# Altium project PCB_Project.PrjPcb
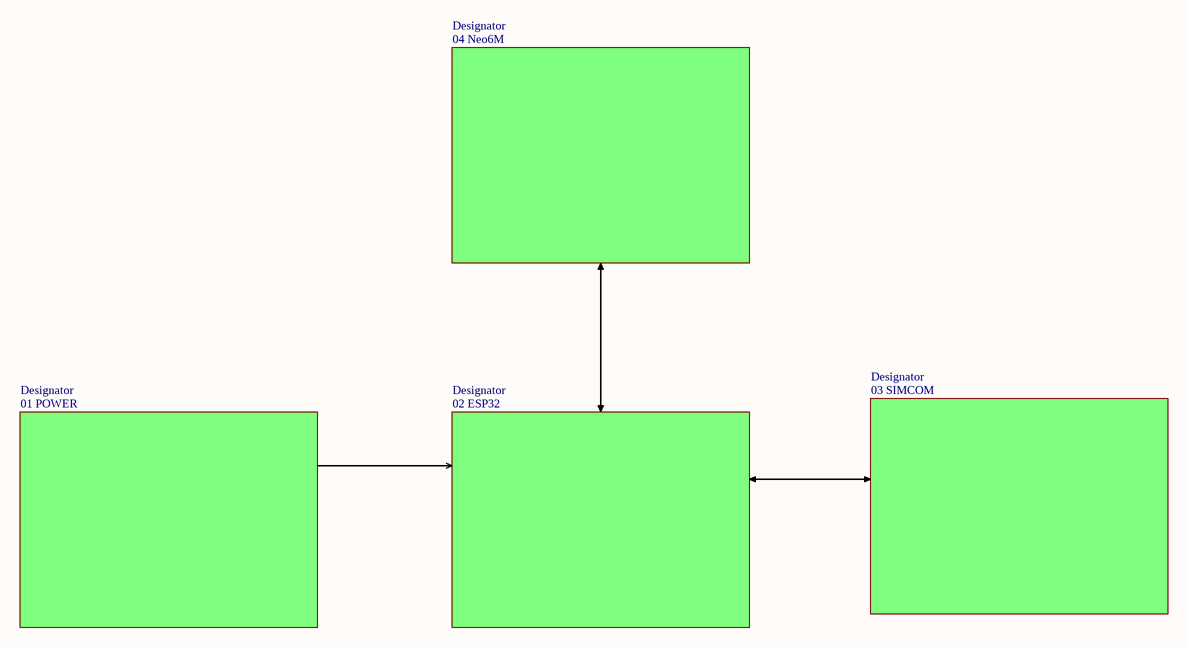
[diagram p0: Sheet1.SchDoc]
5 sheets, 114 parts. Net scope: global (net labels, ports and power ports of the same name join across sheets).
Board file: PCB1.PcbDoc
Sheets:
  Sheet1.SchDoc
    Designator = 01 POWER.SchDoc
    Designator = 02 ESP32.SchDoc
    Designator = 03 SIMCOM.SchDoc
    Designator = 04 Neo6M.SchDoc

## Sheet Sheet1.SchDoc
size A3; SheetNumber: 1; SheetTotal: 5

### Sub-sheets
Designator = 01 POWER: no entries
Designator = 02 ESP32: no entries
Designator = 03 SIMCOM: no entries
Designator = 04 Neo6M: no entries

## Sheet 01 POWER.SchDoc
size A3; SheetNumber: 2; SheetTotal: 5
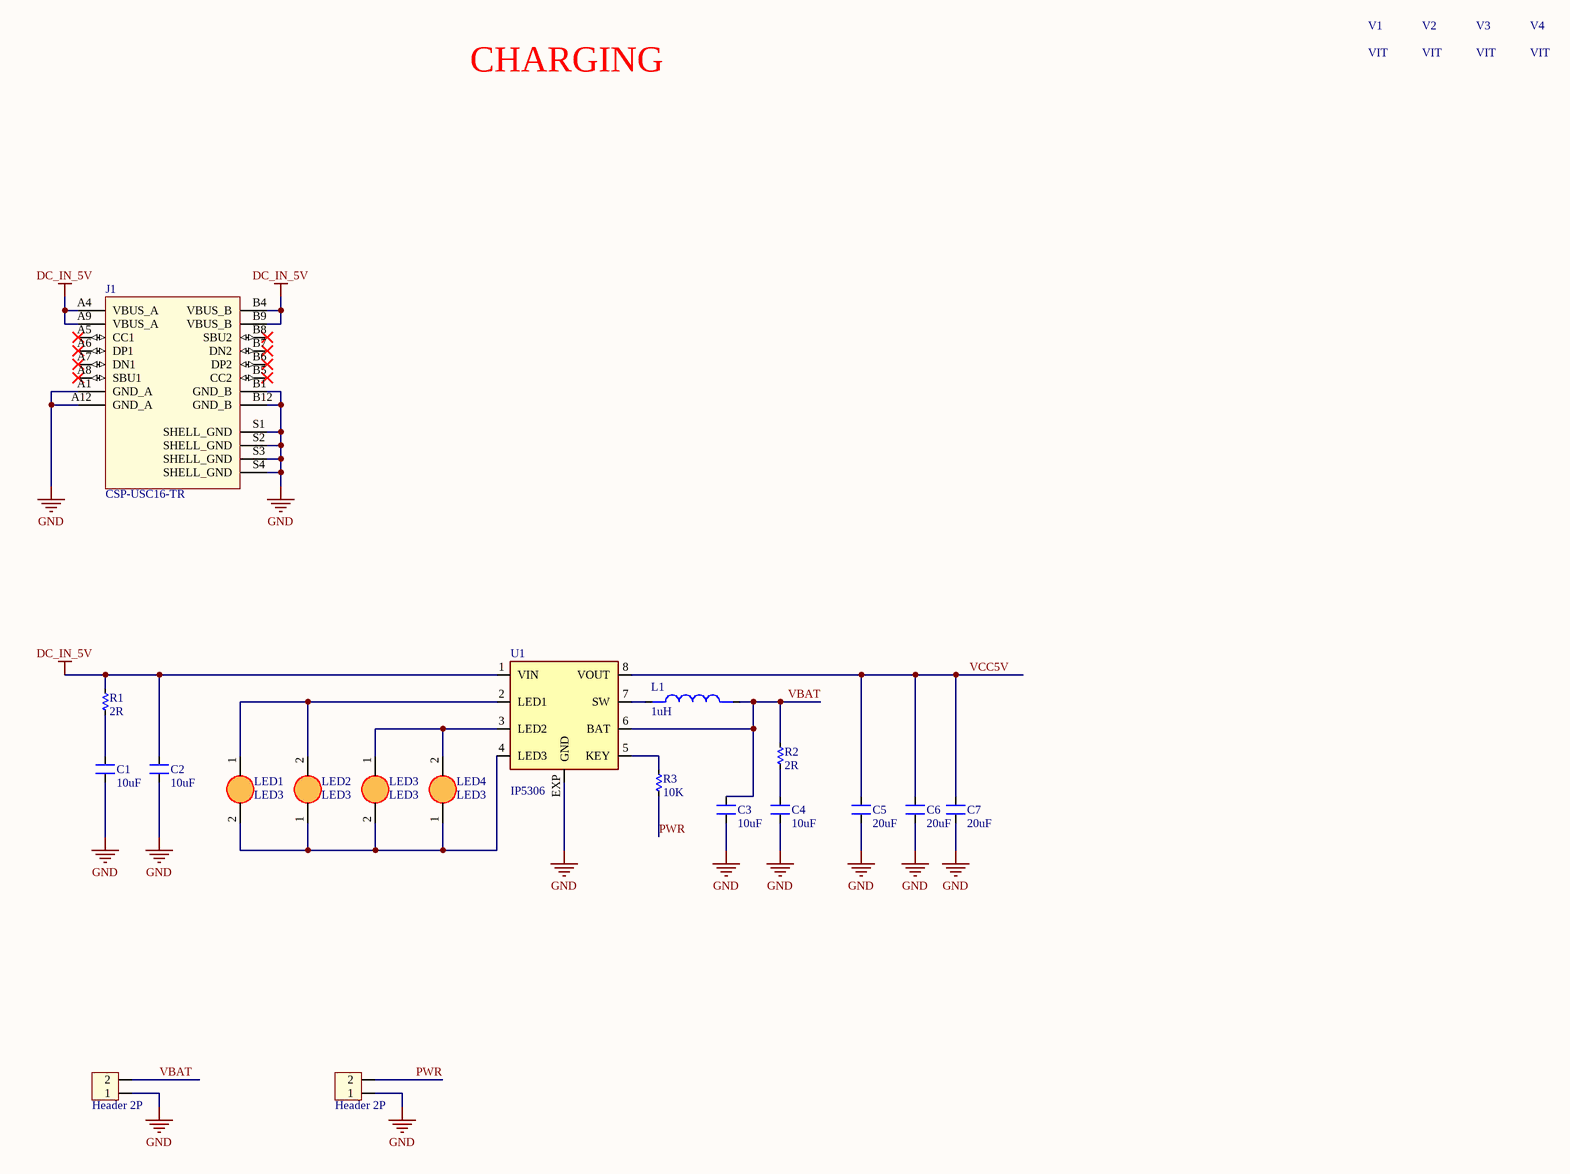
[diagram p1: 01 POWER.SchDoc]

### Parts
C1  10uF  [C 0603]
C2  10uF  [C 0603]
C3  10uF  [C 0603]
C4  10uF  [C 0603]
C5  20uF  [C 0603]
C6  20uF  [C 0603]
C7  20uF  [C 0603]
H1  Header 2P  [Header 2P DC 2.54]
H2  Header 2P  [Header 2P DC 2.54]
J1  CSP-USC16-TR  [VALCON_CSP-USC16-TR]
L1  1uH  [CUON CAM SMD 0530]
LED1  LED3  [LED3mm]
LED2  LED3  [LED3mm]
LED3  LED3  [LED3mm]
LED4  LED3  [LED3mm]
R1  2R  [RES-SMD-0603]
R2  2R  [RES-SMD-0603]
R3  10K  [RES-SMD-0603]
U1  IP5306  [SOP8-P]
V1  VIT  [VIT_01]
V2  VIT  [VIT_01]
V3  VIT  [VIT_01]
V4  VIT  [VIT_01]

### Nets
DC_IN_5V: C2.2 J1.A4(VBUS_A) J1.A9(VBUS_A) J1.B4(VBUS_B) J1.B9(VBUS_B) R1.1 U1.1(VIN)
GND: C1.1 C2.1 C3.1 C4.1 C5.1 C6.1 C7.1 H1.1 H2.1 J1.A1(GND_A) J1.A12(GND_A) J1.B1(GND_B) J1.B12(GND_B) J1.S1(SHELL_GND) J1.S2(SHELL_GND) J1.S3(SHELL_GND) J1.S4(SHELL_GND) U1.EXP(GND)
VCC5V: C5.2 C6.2 C7.2 U1.8(VOUT)
PWR: H2.2 R3.2
VBAT: C3.2 H1.2 L1.2 R2.1 U1.6(BAT)
NetC1_2: C1.2 R1.2
NetC4_2: C4.2 R2.2
NetL1_1: L1.1 U1.7(SW)
NetLED1_1: LED1.1(A) LED2.2(K) U1.2(LED1)
NetLED1_2: LED1.2(K) LED2.1(A) LED3.2(K) LED4.1(A) U1.4(LED3)
NetLED3_1: LED3.1(A) LED4.2(K) U1.3(LED2)
NetR3_1: R3.1 U1.5(KEY)

Not connected (* = marked no-connect by the designer): J1 A5(CC1)* A6(DP1)* A7(DN1)* A8(SBU1)* B5(CC2)* B6(DP2)* B7(DN2)* B8(SBU2)*

### Notes on the sheet
- CHARGING

### Library data of the parts
C1-C7 = CAP_SMD: 16V; Value: 33pF
H1 H2 = Header 2P 2.54 Duc Cong: Cắm; Ten_Linh_Kien: Header 2P XH2.54-2P Đực Cong; Don_Vi: Con; Ma_Hang: MH002852; Chung_Loai: Cắm
J1 = CSP-USC16-TR: CSP-USC16-TR Valcon USB Type C Surface Mount PCB Socket; Package: None; Purchase-URL: https://pricing.snapeda.com/search/part/CSP-USC16-TR/?ref=eda; MP: CSP-USC16-TR; Check_prices: https://www.snapeda.com/parts/CSP-USC16-TR/Valcon/view-part/4783629/?ref=eda; MF: Valcon; Value: *; Availability: No availability data; Price: None; SnapEDA_Link: https://www.snapeda.com/parts/CSP-USC16-TR/Valcon/view-part/4783629/?ref=snap
L1 = Cuon Cam SMD 0530: SMD 0530; MP: FDV0530-H-1R5M=P3; Package: None; Price: None; Value: *; Availability: Unavailable
LED1-LED4 = LED 3mm
R1-R3 = Res-SMD: RES_SMD; Manufacturer: Generic Components; Class: Passive; Published: 08/06/2000; Publisher: Altium Hobart Technology Centre
U1 = IP5306: RC (Pi) EMI Filter 2nd Order Low Pass 2 Channel R = 2.2kOhms, C = 1700pF 8-UFBGA, WLCSP; MF: NXP USA Inc.; Value: *; MP: IP5306; SnapEDA_Link: https://www.snapeda.com/parts/IP5306/NXP+Semiconductors/view-part/?ref=snap; Price: None; Package: UFBGA-8 NXP Semiconductors; Check_prices: https://www.snapeda.com/parts/IP5306/NXP+Semiconductors/view-part/?ref=eda; Availability: Not in stock
V1-V4 = VIT: VIT_3.0mm

## Sheet 02 ESP32.SchDoc
size A3; SheetNumber: 3; SheetTotal: 5
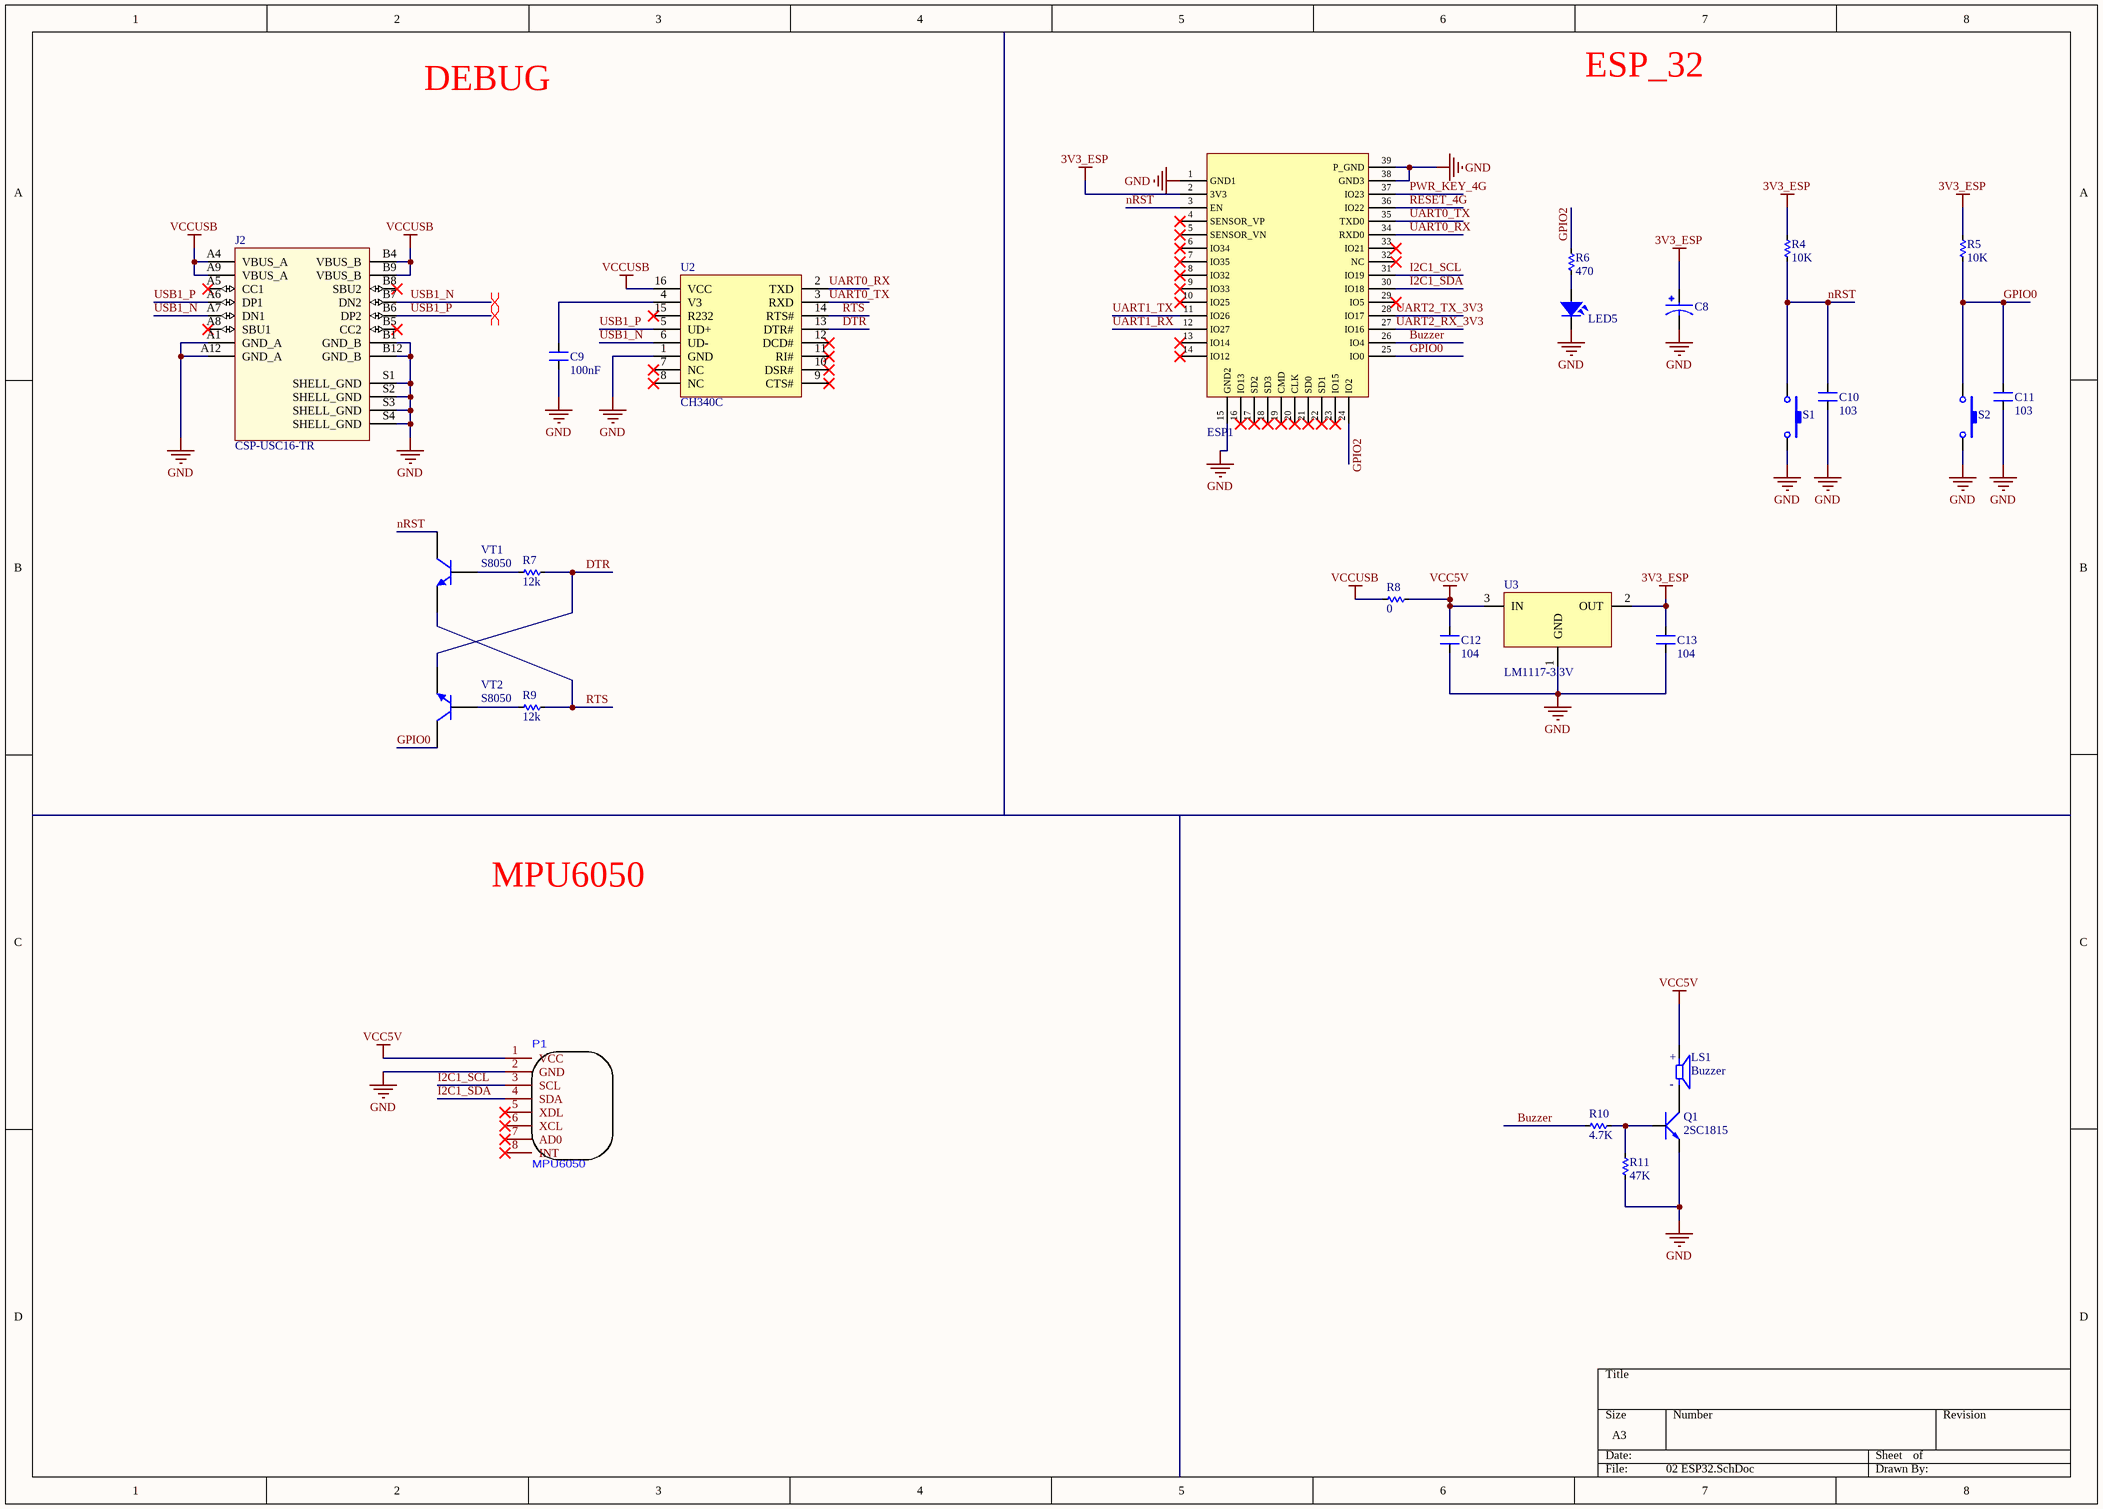
[diagram p2: 02 ESP32.SchDoc]

### Parts
C8  CAP_TANTALUM_SMD  [CAP_TANTALUM_3216]  (value not drawn)
C9  100nF  [C 0603]
C10  103  [C-0603]
C11  103  [C-0603]
C12  104  [C 0603]
C13  104  [C 0603]
ESP1  ESP32  [ESP_WROOM_32]  (value not drawn)
J2  CSP-USC16-TR  [VALCON_CSP-USC16-TR]
LED5  LED  [LED-0603]  (value not drawn)
LS1  Buzzer  [Buzzer-9MM]
P1  MPU6050  [MPU6050]
Q1  2SC1815  [SOT23-321]
R4  10K  [RES-SMD-0603]
R5  10K  [RES-SMD-0603]
R6  470  [RES-SMD-0402]
R7  12k  [RES-SMD-0402]
R8  0  [RES-SMD-0603]
R9  12k  [RES-SMD-0402]
R10  4.7K  [RES-SMD-0603]
R11  47K  [RES-SMD-0603]
S1  SW-SMD  [SW_B3U-1000P]  (value not drawn)
S2  SW-SMD  [SW_B3U-1000P]  (value not drawn)
U2  CH340C  [SOIC16_50_284_25X90_SMT]
U3  LM1117-3.3V  [SOT223]
VT1  S8050  [SMT_TRIODE_NPN]
VT2  S8050  [SMT_TRIODE_NPN]

### Nets
3V3_ESP: C8.1 C13.1 ESP1.2(3V3) R4.1 R5.1 U3.2(OUT)
GND: C8.2 C9.1 C10.1 C11.1 C12.2 C13.2 ESP1.1(GND1) ESP1.15(GND2) ESP1.38(GND3) ESP1.39(P_GND) J2.A1(GND_A) J2.A12(GND_A) J2.B1(GND_B) J2.B12(GND_B) J2.S1(SHELL_GND) J2.S2(SHELL_GND) J2.S3(SHELL_GND) J2.S4(SHELL_GND) LED5.2 P1.2(GND) Q1.1(E) R11.1 S1.2 S2.2 U2.1(GND) U3.1(GND)
VCC5V: C12.1 LS1.1(P) P1.1(VCC) R8.1 U3.3(IN)
VCCUSB: J2.A4(VBUS_A) J2.A9(VBUS_A) J2.B4(VBUS_B) J2.B9(VBUS_B) R8.2 U2.16(VCC)
Buzzer: ESP1.26(IO4) R10.1
DTR: R7.1 U2.13(DTR#) VT2.2(E)
GPIO0: C11.2 ESP1.25(IO0) R5.2 S2.1 VT2.3(C)
GPIO2: ESP1.24(IO2) R6.2
I2C1_SCL: ESP1.31(IO19) P1.3(SCL)
I2C1_SDA: ESP1.30(IO18) P1.4(SDA)
nRST: C10.2 ESP1.3(EN) R4.2 S1.1 VT1.3(C)
PWR_KEY_4G: ESP1.37(IO23)
RESET_4G: ESP1.36(IO22)
RTS: R9.1 U2.14(RTS#) VT1.2(E)
UART0_RX: ESP1.34(RXD0) U2.2(TXD)
UART0_TX: ESP1.35(TXD0) U2.3(RXD)
UART1_RX: ESP1.12(IO27)
UART1_TX: ESP1.11(IO26)
UART2_RX_3V3: ESP1.27(IO16)
UART2_TX_3V3: ESP1.28(IO17)
USB1_N: J2.A7(DN1) J2.B7(DN2) U2.6(UD-)
USB1_P: J2.A6(DP1) J2.B6(DP2) U2.5(UD+)
NetC9_2: C9.2 U2.4(V3)
NetLED5_1: LED5.1 R6.1
NetLS1_2: LS1.2(M) Q1.2(C)
NetQ1_3: Q1.3(B) R10.2 R11.2
NetR7_2: R7.2 VT1.1(B)
NetR9_2: R9.2 VT2.1(B)

Not connected (* = marked no-connect by the designer): ESP1 4(SENSOR_VP)* 5(SENSOR_VN)* 6(IO34)* 7(IO35)* 8(IO32)* 9(IO33)* 10(IO25)* 13(IO14)* 14(IO12)* 16(IO13)* 17(SD2)* 18(SD3)* 19(CMD)* 20(CLK)* 21(SD0)* 22(SD1)* 23(IO15)* 29(IO5)* 32(NC)* 33(IO21)*; J2 A5(CC1)* A8(SBU1)* B5(CC2)* B8(SBU2)*; P1 5(XDL)* 6(XCL)* 7(AD0)* 8(INT)*; U2 7(NC)* 8(NC)* 9(CTS#)* 10(DSR#)* 11(RI#)* 12(DCD#)* 15(R232)*

### Layout directives
differential pair: USB1_N, USB1_P

### Notes on the sheet
- DEBUG
- ESP_32
- MPU6050
- (in symbol Buzzer) +; -

### Library data of the parts
C8 = CAP_TANTALUM_SMD: Capacitor, Tantalum; MF: AVX; MP: TAJB475K025RNJ; SnapEDA_Link: https://www.snapeda.com/parts/TAJB475K025RNJ/AVX/view-part/?ref=snap; Package: 1411 AVX Corporation; Value: *; Check_prices: https://www.snapeda.com/parts/TAJB475K025RNJ/AVX/view-part/?ref=eda
C9 C12 C13 = CAP_SMD: Value: 33pF
C10 C11 = CM: Cap SMD; Value: 103
ESP1 = ESP-WROOM-32
J2 = CSP-USC16-TR: as J1 on sheet 01 POWER; Package: None; Purchase-URL: https://pricing.snapeda.com/search/part/CSP-USC16-TR/?ref=eda; MP: CSP-USC16-TR; Check_prices: https://www.snapeda.com/parts/CSP-USC16-TR/Valcon/view-part/4783629/?ref=eda; MF: Valcon; Value: *; Availability: No availability data; Price: None; SnapEDA_Link: https://www.snapeda.com/parts/CSP-USC16-TR/Valcon/view-part/4783629/?ref=snap
LED5 = LED SMD: Value: LED 3 - 5 ly 2 Colour
LS1 = Buzzer: MP: CST-951AP; Availability: Unavailable; Price: None; Value: *; Package: None
Q1 = 2SC1815: NPN 600mW, ECB; Value: C1815
R4 R5 R8 R10 R11 = Res-SMD: Resistor; Manufacturer: Generic Components; Class: Passive; Published: 08/06/2000; Publisher: Altium Hobart Technology Centre
R6 R7 R9 = Res-SMD: as R1 on sheet 01 POWER; Published: 08/06/2000; Publisher: Altium Hobart Technology Centre
S1 S2 = SW-SMD: Switch; Published: 24-Mar-1999; LatestRevisionDate: 17-Jul-2002; LatestRevisionNote: Re-released for DXP Platform.; PackageReference: SPST-2; Publisher: Altium Limited
U2 = CH340C: USB Bridge, USB to UART USB 2.0 UART Interface; Manufacturer: Olimex; Alternate Part Number-1: NA; Manufacturer Part Number: CH340C; Case/Package: SOIC16; Supplier-1: LCSC; Supplier Part Number-1: C84681
U3 = LM1117: 800mA Low-Dropout Linear Regulator; Creator: Nguyen Ba Bien; Website: http://group3i.net
VT1 VT2 = SMT_TRIODE_NPN: Surface mount NPN transistor, package SOT-23

## Sheet 03 SIMCOM.SchDoc
size A3; SheetNumber: 4; SheetTotal: 5
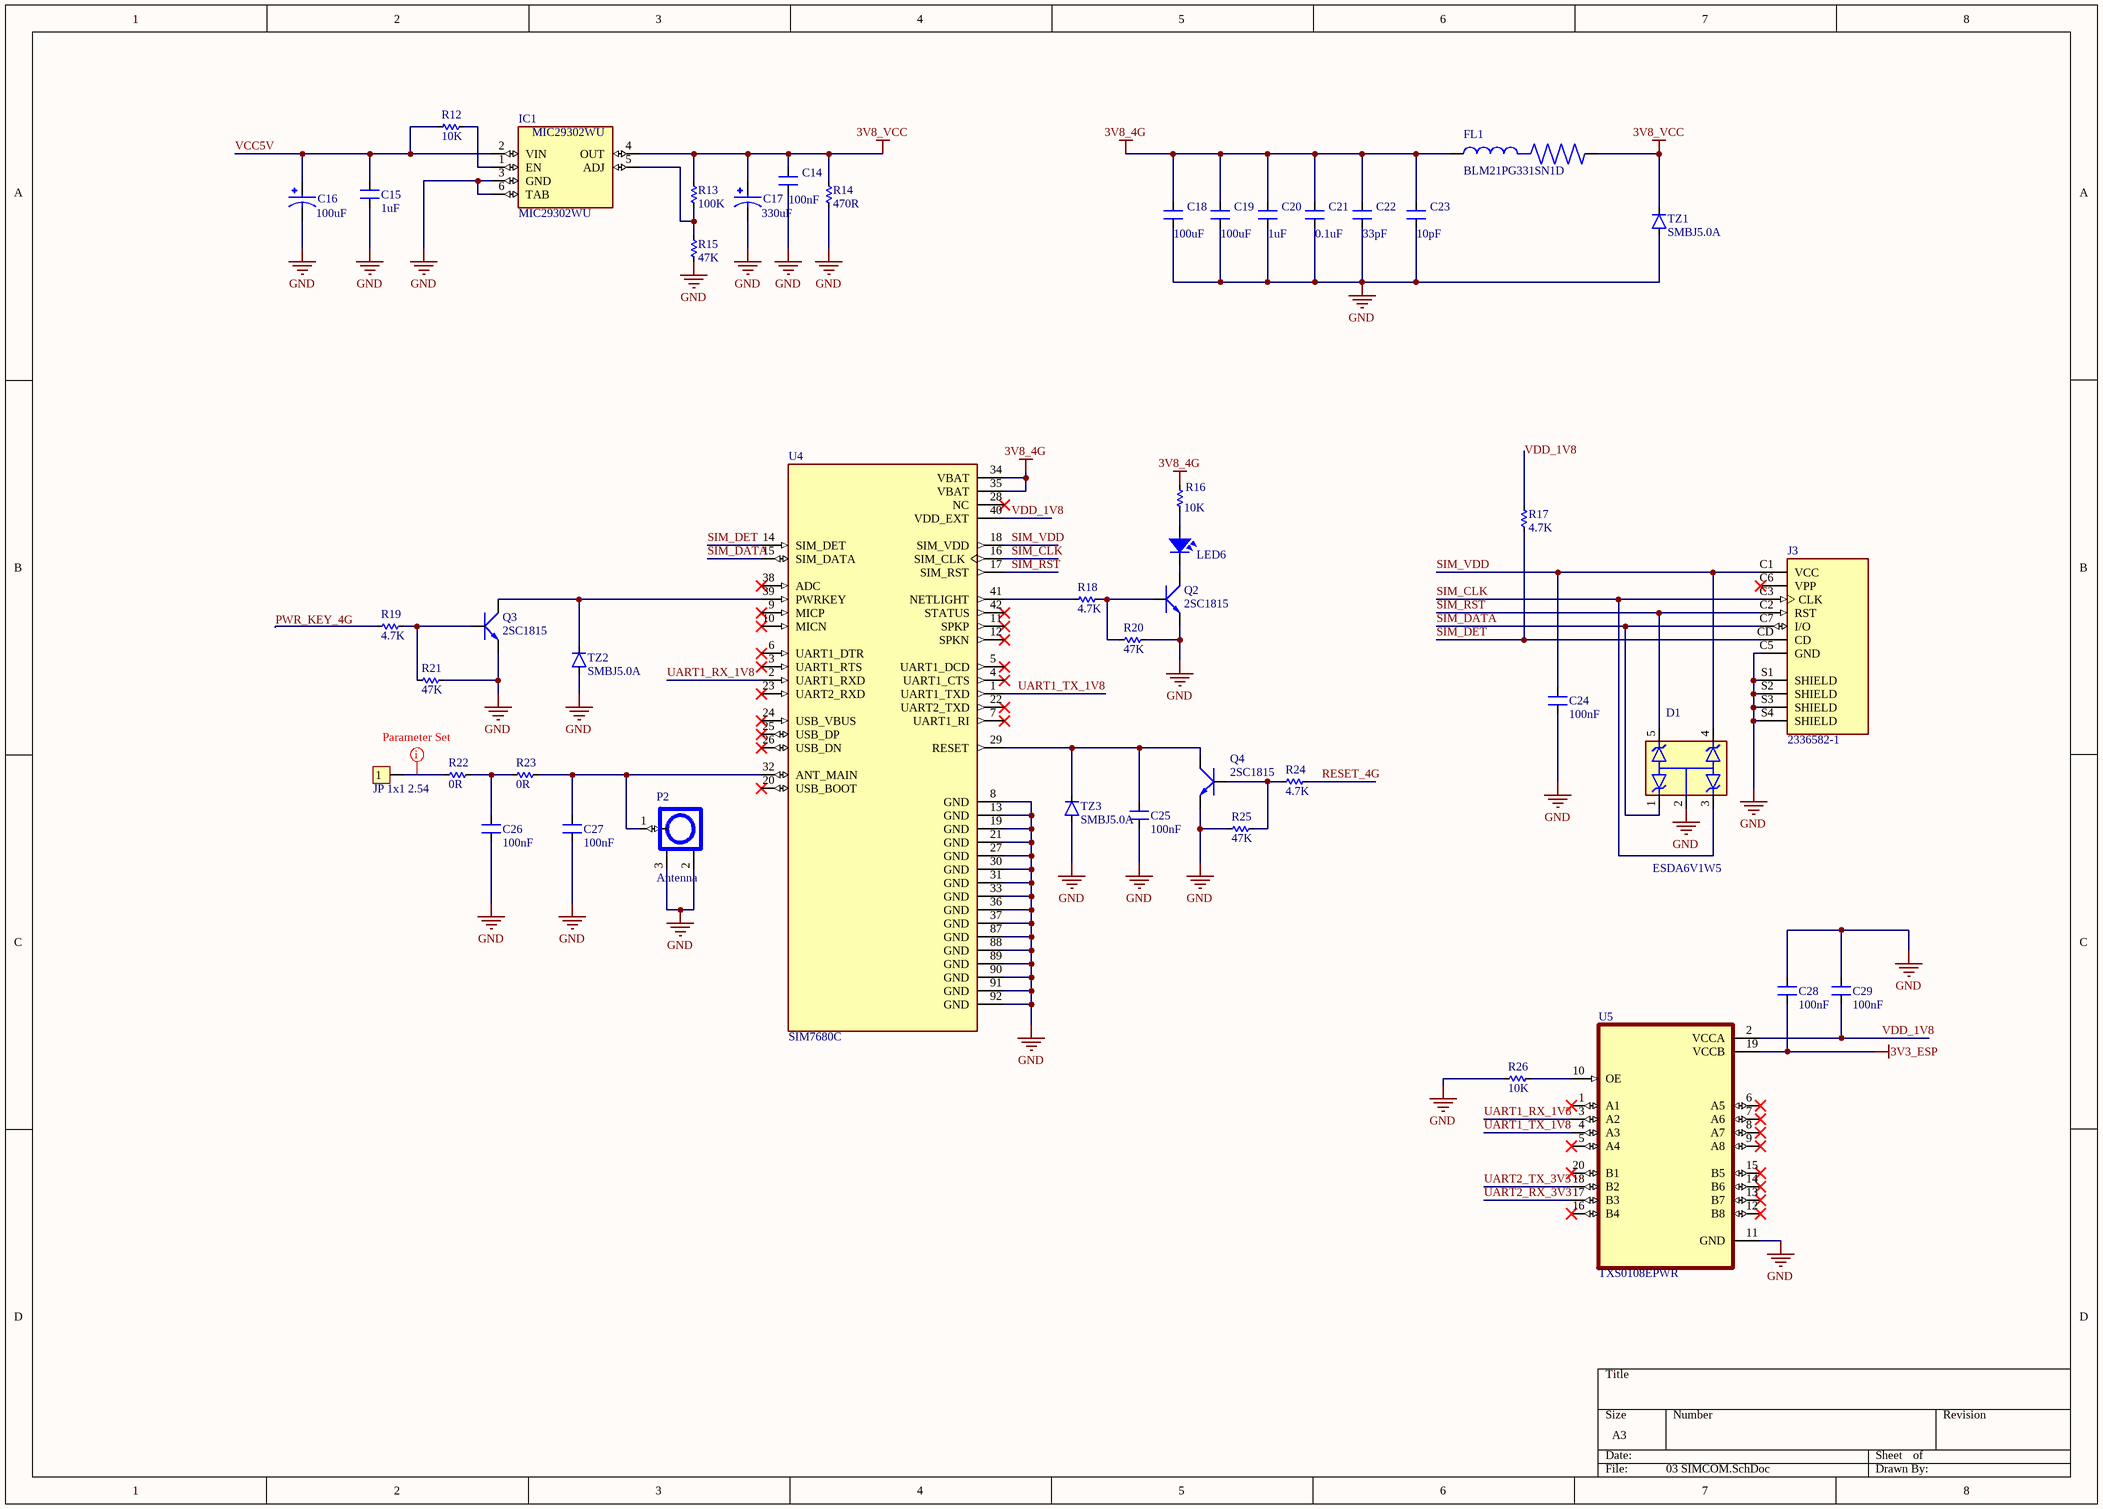
[diagram p3: 03 SIMCOM.SchDoc]

### Parts
C14  100nF  [C 0603]
C15  1uF  [C 0603]
C16  100uF  [CAP_TANTALUM_3528]
C17  330uF  [CAP_TANTALUM_3528]
C18  100uF  [C 0603]
C19  100uF  [C 0603]
C20  1uF  [C 0603]
C21  0.1uF  [C 0603]
C22  33pF  [C 0603]
C23  10pF  [C 0603]
C24  100nF  [C 0603]
C25  100nF  [C 0603]
C26  100nF  [C 0603]
C27  100nF  [C 0603]
C28  100nF  [C 0603]
C29  100nF  [C 0603]
D1  ESDA6V1W5  [SOT65P210X110-5N]
FL1  BLM21PG331SN1D  [BEADC2012X105N]
IC1  MIC29302WU  [MIC29302WU]
J3  2336582-1  [TE_2336582-1]
JP1  JP 1x1 2.54  [JP 1x1 DT]
LED6  LED  [LED-0603]  (value not drawn)
P2  Antenna  [IPXS]
Q2  2SC1815  [SOT23-321]
Q3  2SC1815  [SOT23-321]
Q4  2SC1815  [SOT23-321]
R12  10K  [RES-SMD-0603]
R13  100K  [RES-SMD-0603]
R14  470R  [RES-SMD-0603]
R15  47K  [RES-SMD-0603]
R16  10K  [RES-SMD-0603]
R17  4.7K  [RES-SMD-0603]
R18  4.7K  [RES-SMD-0603]
R19  4.7K  [RES-SMD-0603]
R20  47K  [RES-SMD-0603]
R21  47K  [RES-SMD-0603]
R22  0R  [RES-SMD-0603]
R23  0R  [RES-SMD-0603]
R24  4.7K  [RES-SMD-0603]
R25  47K  [RES-SMD-0603]
R26  10K  [RES-SMD-0603]
TZ1  SMBJ5.0A  [SMB]
TZ2  SMBJ5.0A  [SMB]
TZ3  SMBJ5.0A  [SMB]
U4  SIM7680C  [LCC110P1570X1760X250-42N]
U5  TXS0108EPWR  [SOP65P640X120-20N]

### Nets
3V3_ESP: C28.1 U5.19(VCCB)
3V8_4G: C18.1 C19.1 C20.1 C21.1 C22.1 C23.1 FL1.1 R16.2 U4.34(VBAT) U4.35(VBAT)
3V8_VCC: C14.1 C17.1 FL1.2 IC1.4(OUT) R13.1 R14.1 TZ1.2
GND: C14.2 C15.1 C16.2 C17.2 C18.2 C19.2 C20.2 C21.2 C22.2 C23.2 C24.1 C25.1 C26.1 C27.1 C28.2 C29.2 D1.2 IC1.3(GND) IC1.6(TAB) J3.C5(GND) J3.S1(SHIELD) J3.S2(SHIELD) J3.S3(SHIELD) J3.S4(SHIELD) P2.2 P2.3 Q2.1(E) Q3.1(E) Q4.1(E) R14.2 R15.2 R20.2 R21.1 R25.2 R26.2 TZ1.1 TZ2.1 TZ3.1 U4.8(GND) U4.13(GND) U4.19(GND) U4.21(GND) U4.27(GND) U4.30(GND) U4.31(GND) U4.33(GND) U4.36(GND) U4.37(GND) U4.87(GND) U4.88(GND) U4.89(GND) U4.90(GND) U4.91(GND) U4.92(GND) U5.11(GND)
VCC5V: C15.2 C16.1 IC1.2(VIN) R12.1
PWR_KEY_4G: R19.1
RESET_4G: R24.2
SIM_CLK: D1.3 J3.C3(CLK) U4.16(SIM_CLK)
SIM_DATA: D1.1 J3.C7(I/O) U4.15(SIM_DATA)
SIM_DET: J3.CD R17.2 U4.14(SIM_DET)
SIM_RST: D1.5 J3.C2(RST) U4.17(SIM_RST)
SIM_VDD: C24.2 D1.4 J3.C1(VCC) U4.18(SIM_VDD)
UART1_RX_1V8: U4.2(UART1_RXD) U5.3(A2)
UART1_TX_1V8: U4.1(UART1_TXD) U5.4(A3)
UART2_RX_3V3: U5.17(B3)
UART2_TX_3V3: U5.18(B2)
VDD_1V8: C29.1 R17.1 U4.40(VDD_EXT) U5.2(VCCA)
NetC25_2: C25.2 Q4.2(C) TZ3.2 U4.29(RESET)
NetC26_2: C26.2 R22.1 R23.2
NetC27_2: C27.2 P2.1 R23.1 U4.32(ANT_MAIN)
NetIC1_1: IC1.1(EN) R12.2
NetIC1_5: IC1.5(ADJ) R13.2 R15.1
NetJP1_1: JP1.1 R22.2
NetLED6_1: LED6.1 R16.1
NetLED6_2: LED6.2 Q2.2(C)
NetQ2_3: Q2.3(B) R18.2 R20.1
NetQ3_2: Q3.2(C) TZ2.2 U4.39(PWRKEY)
NetQ3_3: Q3.3(B) R19.2 R21.2
NetQ4_3: Q4.3(B) R24.1 R25.1
NetR18_1: R18.1 U4.41(NETLIGHT)
NetR26_1: R26.1 U5.10(OE)

Not connected (* = marked no-connect by the designer): J3 C6(VPP)*; U4 3(UART1_RTS)* 4(UART1_CTS)* 5(UART1_DCD)* 6(UART1_DTR)* 7(UART1_RI)* 9(MICP)* 10(MICN)* 11(SPKP)* 12(SPKN)* 20(USB_BOOT)* 22(UART2_TXD)* 23(UART2_RXD)* 24(USB_VBUS)* 25(USB_DP)* 26(USB_DN)* 28(NC)* 38(ADC)* 42(STATUS)*; U5 1(A1)* 5(A4)* 6(A5)* 7(A6)* 8(A7)* 9(A8)* 12(B8)* 13(B7)* 14(B6)* 15(B5)* 16(B4)* 20(B1)*

### Library data of the parts
C14 C18-C21 C23-C29 = CAP_SMD: Value: 33pF
C15 = CAP_SMD: 16V; Value: 33pF
C16 C17 = CAP_TANTALUM_SMD: as C8 on sheet 02 ESP32; SnapEDA_Link: https://www.snapeda.com/parts/TAJB475K025RNJ/AVX/view-part/?ref=snap; Package: 1411 AVX Corporation; Value: *; Check_prices: https://www.snapeda.com/parts/TAJB475K025RNJ/AVX/view-part/?ref=eda
C22 = CAP_SMD: Value: 33pF
D1 = ESDA6V1W5: - Clamp - Ipp Tvs Diode Surface Mount SOT-323-5; MF: STMicroelectronics; SnapEDA_Link: https://www.snapeda.com/parts/ESDA6V1W5/STMicroelectronics/view-part/?ref=snap; Availability: In Stock; Price: None; Value: *; Check_prices: https://www.snapeda.com/parts/ESDA6V1W5/STMicroelectronics/view-part/?ref=eda; Purchase-URL: https://pricing.snapeda.com/search/part/ESDA6V1W5/?ref=eda; MP: ESDA6V1W5; Package: SOT-323 STMicroelectronics
FL1 = BLM21PG331SN1D: SMD Ferrite 0805 330 Ohm +-25% 6000mA; Package: None; Price: None; Availability: Unavailable; MP: BLM21PG331SN1D; Value: *
IC1 = MIC29302WU: MF: {'manufacturer': u'Microchip Technology'}; Package: None; Price: None; Value: *; MP: MIC29302WU; Availability: Unavailable
J3 = 2336582-1: PUSH-PUSH NANO SIM CONNECTOR; Package: None; Price: None; Value: *; MP: 2336582-1; Availability: Unavailable
JP1 = JP 1x1 2.54 Duc Cong: Cắm; Ten_Linh_Kien: Jump Đơn Đực 2.54MM 1x40P Cong Đứng; Don_Vi: Con; Ma_Hang: MH000904; Ghi_Chu: *; Kieu_Chan: *; Chung_Loai: Cắm
LED6 = LED SMD: Value: LED 3 - 5 ly 2 Colour
P2 = IPXSx66: Antenna GSM GPS
Q2-Q4 = 2SC1815: NPN 600mW, ECB; Value: C1815
R12-R26 = Res-SMD: as R1 on sheet 01 POWER; Published: 08/06/2000; Publisher: Altium Hobart Technology Centre
TZ1-TZ3 = SMBJ5.0A: 9.2V Clamp 65.3A Ipp Tvs Diode Surface Mount DO-214AA _SMBJ_; MF: Littelfuse; MP: SMBJ5.0A; Availability: Unavailable; SnapEDA_Link: https://www.snapeda.com/parts/SMBJ5.0A/Littelfuse%20Inc/view-part/225678/?ref=snap; Package: DO-214 Bourns; Price: None; Value: *
U4 = SIM7680C: Module: GSM/Bluetooth; GPRS; 2G; 1800MHz, 900MHz; 85.6kbps; SMD; MP: SIM800C; MF: Simcom; Check_prices: https://www.snapeda.com/parts/SIM800C/SIMcom+Wireless+solutions+Co.%252CLtd/view-part/?ref=eda; Value: *; Availability: In Stock; Price: None; Package: None; SnapEDA_Link: https://www.snapeda.com/parts/SIM800C/SIMcom+Wireless+solutions+Co.%252CLtd/view-part/?ref=snap
U5 = TXS0108EPWR: 8-bit bidirectional voltage-level shifter for open-drain and push-pull application; MF: Texas Instruments; Value: *; SnapEDA_Link: https://www.snapeda.com/parts/TXS0108EPWR/Texas+Instruments/view-part/?ref=snap; Purchase-URL: https://pricing.snapeda.com/search/part/TXS0108EPWR/?ref=eda; Availability: In Stock; Price: None; Package: TSSOP-20 Texas Instruments; Check_prices: https://www.snapeda.com/parts/TXS0108EPWR/Texas+Instruments/view-part/?ref=eda; MP: TXS0108EPWR

## Sheet 04 Neo6M.SchDoc
size A3; SheetNumber: 5; SheetTotal: 5
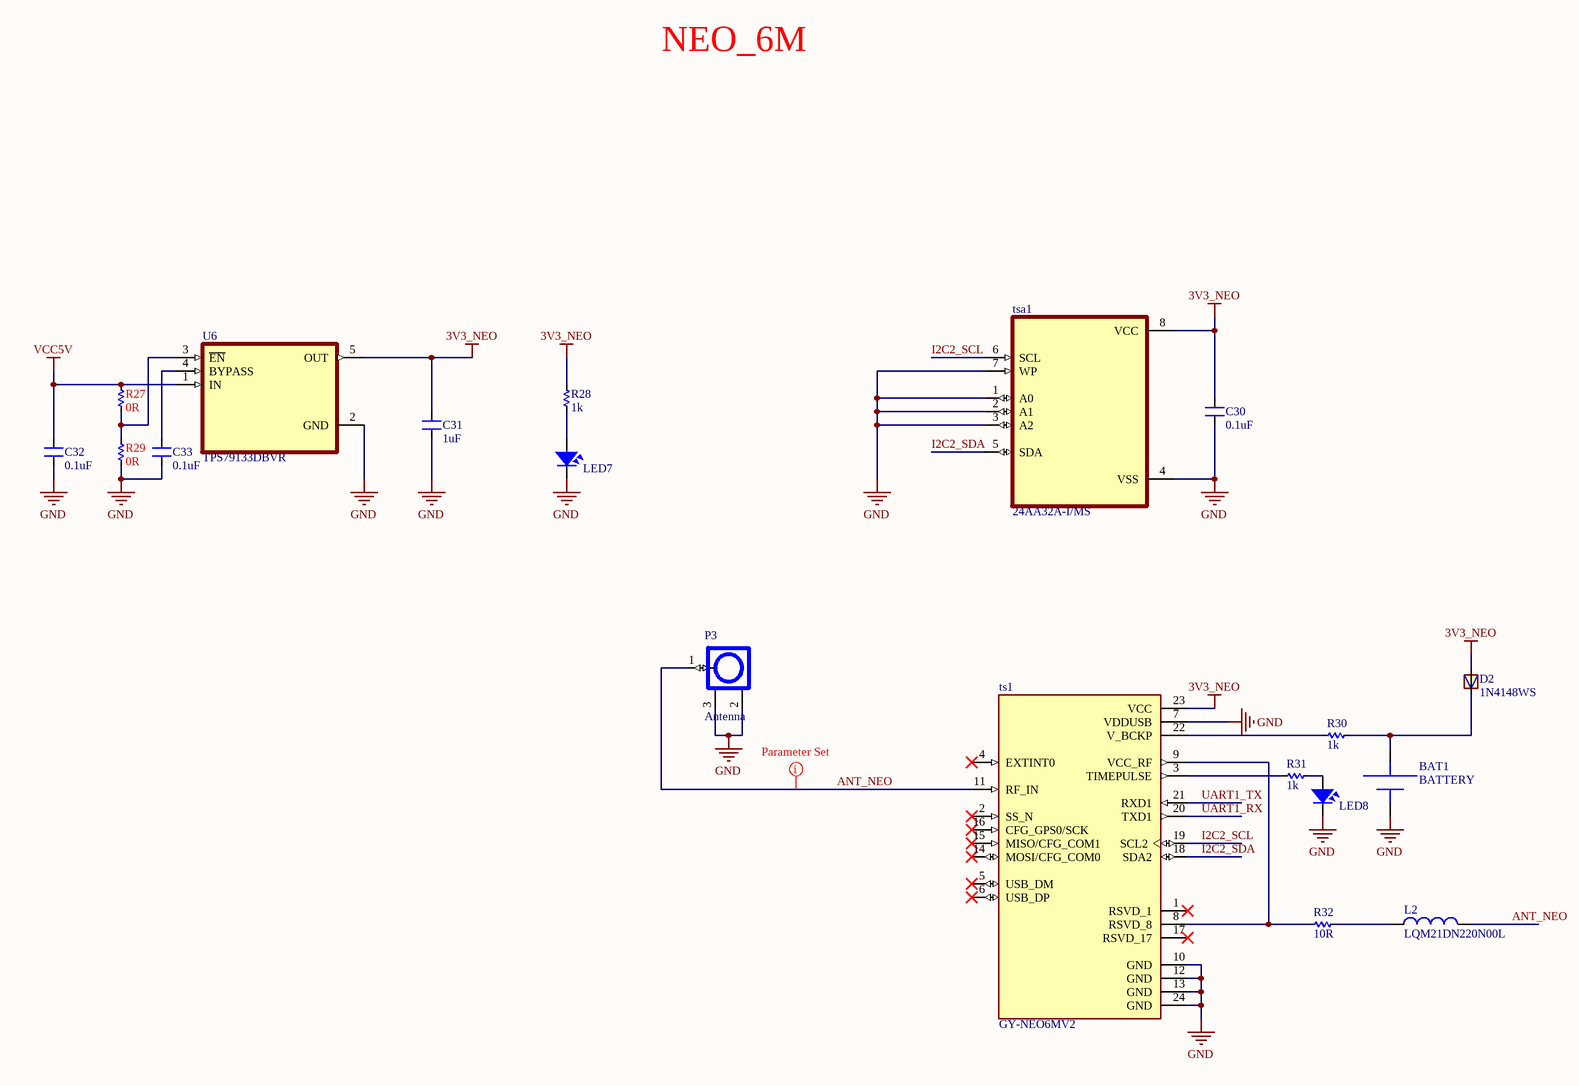
[diagram p4: 04 Neo6M.SchDoc]

### Parts
BAT1  BATTERY  [BATTERY_CON]
C30  0.1uF  [C 0603]
C31  1uF  [C 0603]
C32  0.1uF  [C 0603]
C33  0.1uF  [C 0603]
D2  1N4148WS  [SOD323]
L2  LQM21DN220N00L  [INDC2012X145N]
LED7  LED  [LED-0603]  (value not drawn)
LED8  LED  [LED-0603]  (value not drawn)
P3  Antenna  [IPXS]
R27  0R  [RES-SMD-0603]
R28  1k  [RES-SMD-0603]
R29  0R  [RES-SMD-0603]
R30  1k  [RES-SMD-0603]
R31  1k  [RES-SMD-0603]
R32  10R  [RES-SMD-0603]
ts1  GY-NEO6MV2  [XCVR_GY-NEO6MV2]
tsa1  24AA32A-I/MS  [SOP65P490X110-8N]
U6  TPS79133DBVR  [SOT95P280X145-5N]

### Nets
3V3_NEO: C30.2 C31.2 D2.A R28.1 ts1.23(VCC) tsa1.8(VCC) U6.5(OUT)
GND: BAT1.0 C30.1 C31.1 C32.1 C33.1 LED7.2 LED8.2 P3.2 P3.3 R29.2 ts1.7(VDDUSB) ts1.10(GND) ts1.12(GND) ts1.13(GND) ts1.24(GND) tsa1.1(A0) tsa1.2(A1) tsa1.3(A2) tsa1.4(VSS) tsa1.7(WP) U6.2(GND)
VCC5V: C32.2 R27.1 U6.1(IN)
ANT_NEO: L2.2 P3.1 ts1.11(RF_IN)
I2C2_SCL: ts1.19(SCL2) tsa1.6(SCL)
I2C2_SDA: ts1.18(SDA2) tsa1.5(SDA)
UART1_RX: ts1.20(TXD1)
UART1_TX: ts1.21(RXD1)
NetBAT1_1: BAT1.1 D2.C R30.1
NetC33_2: C33.2 U6.4(BYPASS)
NetL2_1: L2.1 R32.1
NetLED7_1: LED7.1 R28.2
NetLED8_1: LED8.1 R31.1
NetR27_2: R27.2 R29.1 U6.3(~{EN})
NetR30_2: R30.2 ts1.22(V_BCKP)
NetR31_2: R31.2 ts1.3(TIMEPULSE)
NetR32_2: R32.2 ts1.8(RSVD_8) ts1.9(VCC_RF)

Not connected (* = marked no-connect by the designer): ts1 1(RSVD_1)* 2(SS_N)* 4(EXTINT0)* 5(USB_DM)* 6(USB_DP)* 14(MOSI/CFG_COM0)* 15(MISO/CFG_COM1)* 16(CFG_GPS0/SCK)* 17(RSVD_17)*

### Notes on the sheet
- NEO_6M

### Library data of the parts
C30-C33 = CAP_SMD: 16V; Value: 33pF
D2 = 1N4148WS: Small Signal Diode, SOD-323F, 100V, 0.15A, 150Â°C; MF: Diotec Semiconductor; SnapEDA_Link: https://www.snapeda.com/parts/1N4148WS/Diotec/view-part/?ref=snap; Package: SOD-323F Diotec; Value: *; MP: 1N4148WS; Check_prices: https://www.snapeda.com/parts/1N4148WS/Diotec/view-part/?ref=eda
L2 = LQM21DN220N00L: Inductor with Inductance: 22uH Tol. +/-30%, Package: 0805 (2012); MF: Murata; Purchase-URL: https://pricing.snapeda.com/search/part/LQM21DN220N00L/?ref=eda; Price: None; SnapEDA_Link: https://www.snapeda.com/parts/LQM21DN220N00L/Murata%20Electronics%20North%20America/view-part/518317/?ref=snap; Package: 2012 Bourns; Availability: Warning; Value: *; MP: LQM21DN220N00L
LED7 LED8 = LED SMD: Value: LED 3 - 5 ly 2 Colour
P3 = IPXSx66: Antenna GSM GPS
R27-R32 = Res-SMD: as R1 on sheet 01 POWER; Published: 08/06/2000; Publisher: Altium Hobart Technology Centre
ts1 = GY-NEO6MV2: The NEO-6 module series is a family of stand-alone GPS receivers featuring the high performance u-blox 6positioning engine.; MF: Ublox; SnapEDA_Link: https://www.snapeda.com/parts/GY-NEO6MV2/Ublox/view-part/?ref=snap; Package: Package; Value: *; MP: GY-NEO6MV2; Check_prices: https://www.snapeda.com/parts/GY-NEO6MV2/Ublox/view-part/?ref=eda
tsa1 = 24AA32A-I/MS: EEPROM Memory IC 32Kb _4K x 8_ IÂ²C 400kHz 900ns 8-MSOP; MF: Microchip; Price: None; SnapEDA_Link: https://www.snapeda.com/parts/24AA32A-I/MS/Microchip/view-part/138275/?ref=snap; MP: 24AA32A-I/MS; Value: *; Availability: Unavailable; Package: MSOP-8 Microchip
U6 = TPS79133DBVR: 100-mA, low-noise, low-dropout voltage regulator with enable; MF: Texas Instruments; Price: None; Availability: In Stock; Package: SOT-23-5 Texas Instruments; MP: TPS79133DBVR; Value: *; SnapEDA_Link: https://www.snapeda.com/parts/TPS79133DBVR/Texas+Instruments/view-part/?ref=snap; Purchase-URL: https://pricing.snapeda.com/search/part/TPS79133DBVR/?ref=eda; Check_prices: https://www.snapeda.com/parts/TPS79133DBVR/Texas+Instruments/view-part/?ref=eda

## Nets that join several sheets
3V3_ESP: 02 ESP32 (6 pins), 03 SIMCOM (C28.1 U5.19)
GND: 01 POWER (18 pins), 02 ESP32 (26 pins), 03 SIMCOM (55 pins), 04 Neo6M (21 pins)
VCC5V: 01 POWER (C5.2 C6.2 C7.2 U1.8), 02 ESP32 (5 pins), 03 SIMCOM (C15.2 C16.1 IC1.2 R12.1), 04 Neo6M (C32.2 R27.1 U6.1)
PWR_KEY_4G: 02 ESP32 (ESP1.37), 03 SIMCOM (R19.1)
RESET_4G: 02 ESP32 (ESP1.36), 03 SIMCOM (R24.2)
UART1_RX: 02 ESP32 (ESP1.12), 04 Neo6M (ts1.20)
UART1_TX: 02 ESP32 (ESP1.11), 04 Neo6M (ts1.21)
UART2_RX_3V3: 02 ESP32 (ESP1.27), 03 SIMCOM (U5.17)
UART2_TX_3V3: 02 ESP32 (ESP1.28), 03 SIMCOM (U5.18)